# EAGLE schematic VoltageControlledEuclideanSequencer (EAGLE 6.6.0)
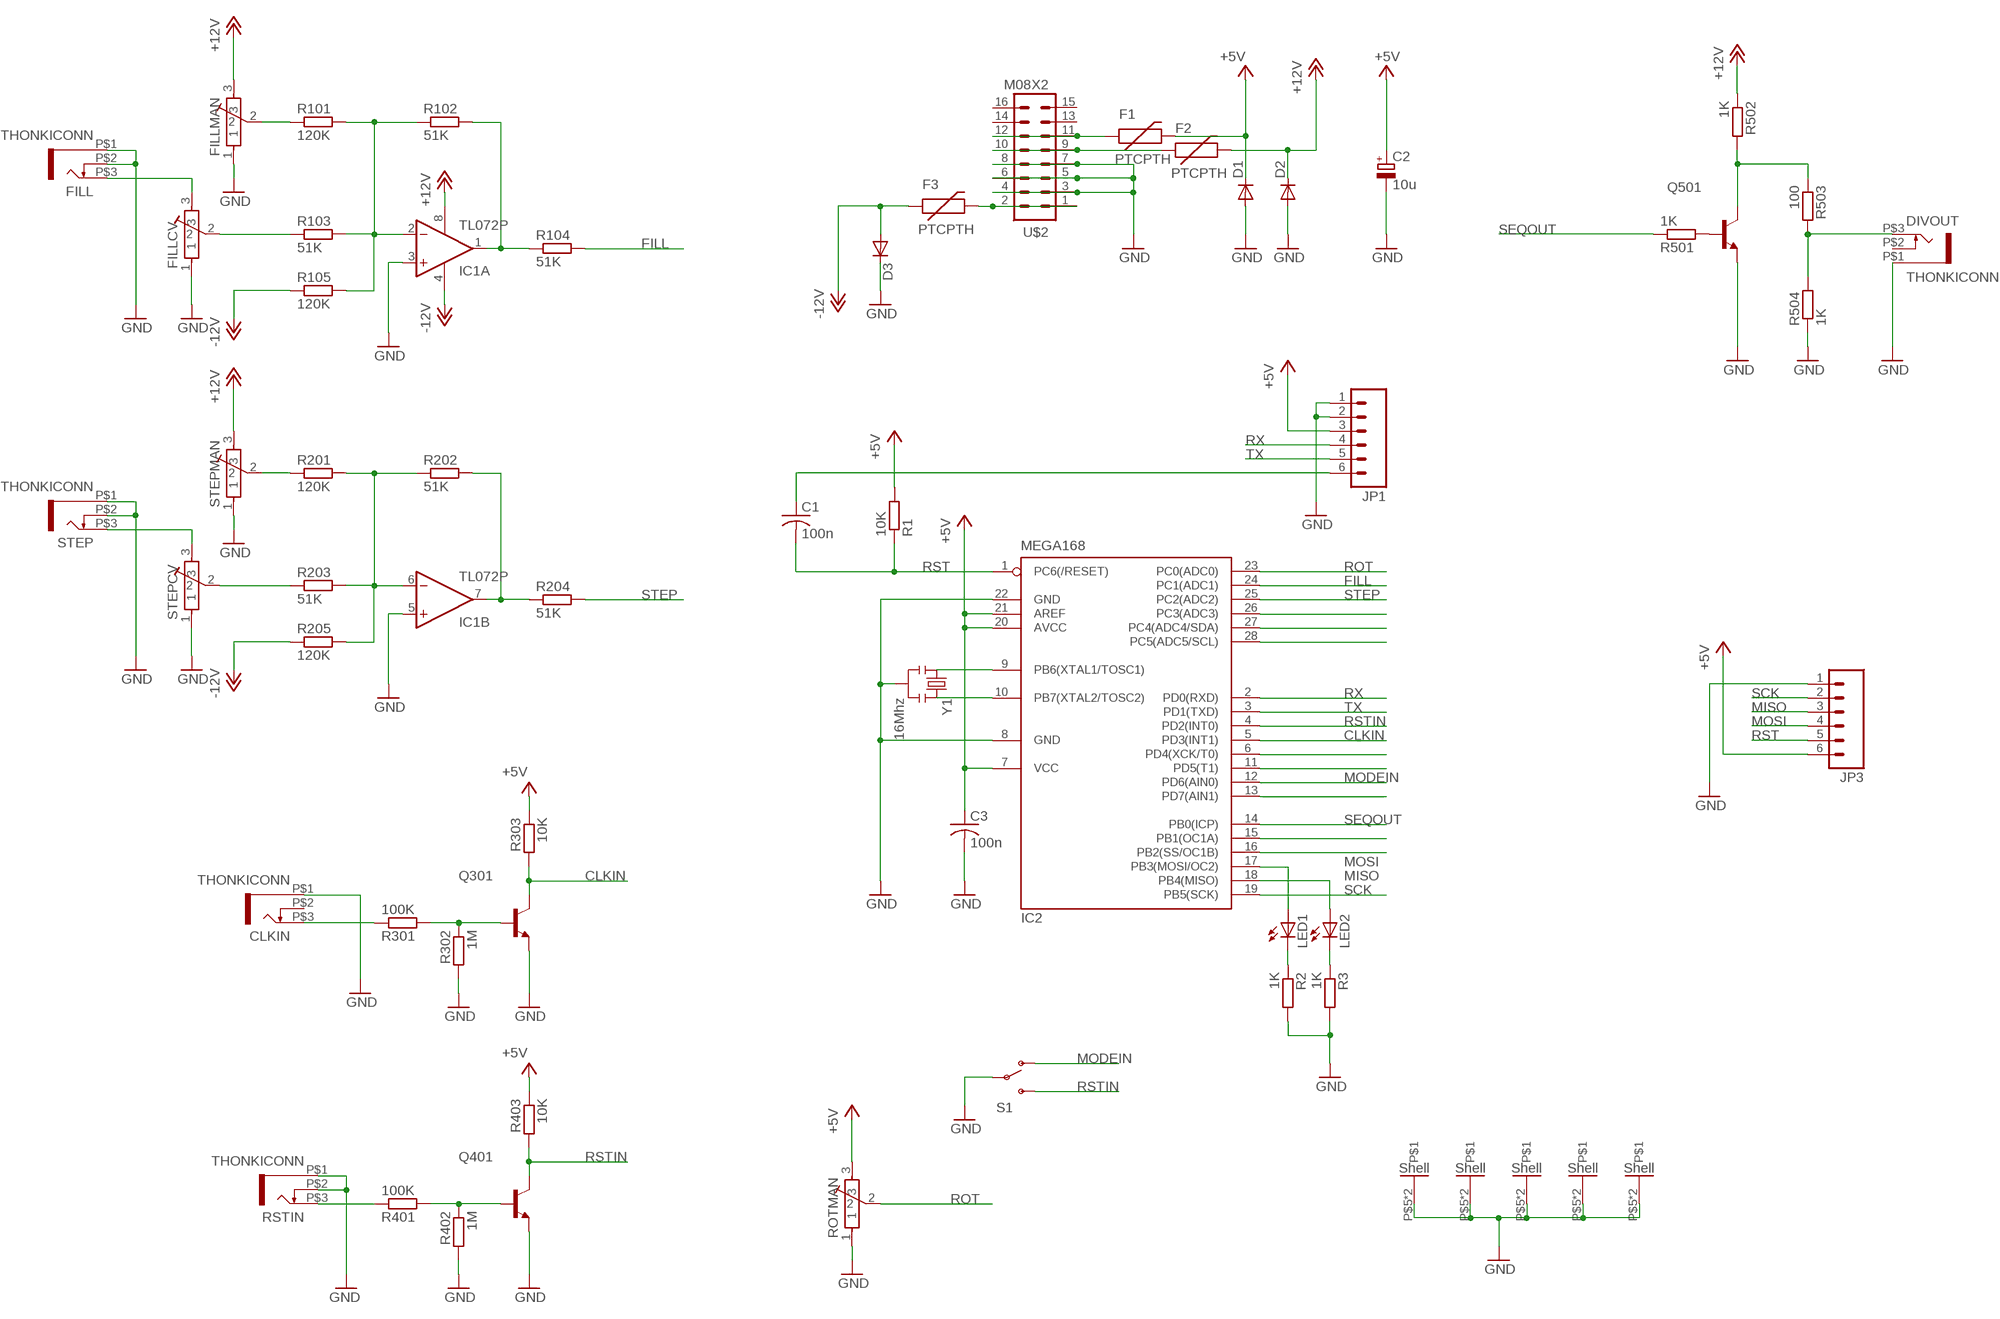
[diagram p0: schematic, sheet 1]

## Parts
C1  100n  C-US050-024X044  [C050-024X044]
C2  10u  CPOL-EUE2.5-6  [E2,5-6]
C3  100n  C-US050-024X044  [C050-024X044]
CLKIN  THONKICONN  [THONKICONN]
D1  DIODE1N4001  [DIODE-1N4001]
D2  DIODE1N4001  [DIODE-1N4001]
D3  DIODE1N4001  [DIODE-1N4001]
DIVOUT  THONKICONN  [THONKICONN]
F1  PTCPTH  [PTC]
F2  PTCPTH  [PTC]
F3  PTCPTH  [PTC]
FILL  THONKICONN  [THONKICONN]
FILLCV  POT-ALPS-RK09L1140  [POT-ALPS-RK09L1140]
FILLMAN  POT-ALPS-RK09L1140  [POT-ALPS-RK09L1140]
IC1  TL072P  [DIL08]
IC2  MEGA168  MEGA8-P  [DIL28-3]
JP1  M06SIP  [1X06]
JP3  M06SIP  [1X06]
LED1  LED3MM  [LED3MM]
LED2  LED3MM  [LED3MM]
Q301  2N3904-NPN-TO92-EBC  [TO92-EBC]
Q401  2N3904-NPN-TO92-EBC  [TO92-EBC]
Q501  2N3904-NPN-TO92-EBC  [TO92-EBC]
R1  10K  R-EU_0204/7  [0204/7]
R2  1K  R-EU_0204/7  [0204/7]
R3  1K  R-EU_0204/7  [0204/7]
R101  120K  R-EU_0204/7  [0204/7]
R102  51K  R-EU_0204/7  [0204/7]
R103  51K  R-EU_0204/7  [0204/7]
R104  51K  R-EU_0204/7  [0204/7]
R105  120K  R-EU_0204/7  [0204/7]
R201  120K  R-EU_0204/7  [0204/7]
R202  51K  R-EU_0204/7  [0204/7]
R203  51K  R-EU_0204/7  [0204/7]
R204  51K  R-EU_0204/7  [0204/7]
R205  120K  R-EU_0204/7  [0204/7]
R301  100K  R-EU_0204/7  [0204/7]
R302  1M  R-EU_0204/7  [0204/7]
R303  10K  R-EU_0204/7  [0204/7]
R401  100K  R-EU_0204/7  [0204/7]
R402  1M  R-EU_0204/7  [0204/7]
R403  10K  R-EU_0204/7  [0204/7]
R501  1K  R-EU_0204/7  [0204/7]
R502  1K  R-EU_0204/7  [0204/7]
R503  100  R-EU_0204/7  [0204/7]
R504  1K  R-EU_0204/7  [0204/7]
ROTMAN  POT-ALPS-RK09L1140  [POT-ALPS-RK09L1140]
RSTIN  THONKICONN  [THONKICONN]
S1  SWITCH-SPST  [SWITCH-SPDT-SALECOM-T8014]
STEP  THONKICONN  [THONKICONN]
STEPCV  POT-ALPS-RK09L1140  [POT-ALPS-RK09L1140]
STEPMAN  POT-ALPS-RK09L1140  [POT-ALPS-RK09L1140]
U$2  M08X2  [2X8]
Y1  16Mhz  RESONATORPTH  [RESONATOR-PTH]

## Nets
+5V: C2.+ C3.1 D1.C F1.P$2 IC2.7(VCC) IC2.20(AVCC) IC2.21(AREF) JP1.3 JP3.6 R1.2 R303.1 R403.1 ROTMAN.3
+12V: D2.C F2.P$2 FILLMAN.3 IC1.8(P:V+) R502.1 STEPMAN.3
-12V: D3.A F3.P$1 IC1.4(P:V-) R105.1 R205.1
ALT: IC2.11(PD5(T1))
CLKIN: IC2.5(PD3(INT1)) Q301.C R303.2
CMBOUT: IC2.16(PB2(SS/OC1B))
DELOUT: IC2.15(PB1(OC1A))
FILL: IC2.24(PC1(ADC1)) R104.2
GND: C2.- C3.2 CLKIN.P$1 D1.A D2.A D3.C DIVOUT.P$1 FILL.P$1 FILL.P$2 FILLCV.1 FILLCV.P$5 FILLCV.P$6 FILLMAN.1 FILLMAN.P$5 FILLMAN.P$6 IC1.3(A:+IN) IC1.5(B:+IN) IC2.8(GND) IC2.22(GND) JP1.1 JP1.2 JP3.1 Q301.E Q401.E Q501.E R2.2 R3.2 R302.2 R402.2 R504.1 ROTMAN.1 ROTMAN.P$5 ROTMAN.P$6 RSTIN.P$1 RSTIN.P$2 S1.2(P) STEP.P$1 STEP.P$2 STEPCV.1 STEPCV.P$5 STEPCV.P$6 STEPMAN.1 STEPMAN.P$5 STEPMAN.P$6 U$2.3 U$2.4 U$2.5 U$2.6 U$2.7 U$2.8 Y1.2
MISO: IC2.18(PB4(MISO)) JP3.3 LED2.A
MODEB: IC2.13(PD7(AIN1))
MODEIN: IC2.12(PD6(AIN0)) S1.1(O)
MOSI: IC2.17(PB3(MOSI/OC2)) JP3.4 LED1.A
N$1: FILL.P$3 FILLCV.3
N$2: IC1.2(A:-IN) R101.2 R102.1 R103.2 R105.2
N$3: FILLMAN.2 R101.1
N$4: IC1.1(A:OUT) R102.2 R104.1
N$5: FILLCV.2 R103.1
N$6: F3.P$2 U$2.1 U$2.2
N$7: IC1.6(B:-IN) R201.2 R202.1 R203.2 R205.2
N$8: R201.1 STEPMAN.2
N$9: IC1.7(B:OUT) R202.2 R204.1
N$10: R203.1 STEPCV.2
N$12: STEP.P$3 STEPCV.3
N$15: IC2.26(PC3(ADC3))
N$16: IC2.27(PC4(ADC4/SDA))
N$17: IC2.28(PC5(ADC5/SCL))
N$20: IC2.9(PB6(XTAL1/TOSC1)) Y1.1
N$21: IC2.10(PB7(XTAL2/TOSC2)) Y1.3
N$23: LED1.K(C) R2.1
N$24: LED2.K(C) R3.1
N$27: Q301.B R301.2 R302.1
N$28: CLKIN.P$3 R301.1
N$29: C1.1 JP1.6
N$31: Q401.B R401.2 R402.1
N$33: Q501.B R501.2
N$36: DIVOUT.P$3 R503.2 R504.2
N$37: Q501.C R502.2 R503.1
N$40: R401.1 RSTIN.P$3
N$44: F1.P$1 U$2.11 U$2.12
N$45: F2.P$1 U$2.9 U$2.10
ROT: IC2.23(PC0(ADC0)) ROTMAN.2
RST: C1.2 IC2.1(PC6(/RESET)) JP3.5 R1.1
RSTIN: IC2.4(PD2(INT0)) Q401.C R403.2 S1.3(S)
RX: IC2.2(PD0(RXD)) JP1.4
SCK: IC2.19(PB5(SCK)) JP3.2
SEQOUT: IC2.14(PB0(ICP)) R501.1
STEP: IC2.25(PC2(ADC2)) R204.2
TRIG: IC2.6(PD4(XCK/T0))
TX: IC2.3(PD1(TXD)) JP1.5
Unconnected: CLKIN.P$2 DIVOUT.P$2 U$2.13 U$2.14 U$2.15 U$2.16

## Library data of the parts
C1 C3 = rcl:C-US: CAPACITOR, American symbol
C2 = resistor:CPOL-EU: POLARIZED CAPACITOR, European symbol
CLKIN DIVOUT FILL RSTIN STEP = Rebel:THONKICONN
D1-D3 = Rebel:DIODE: Diode
F1-F3 = Rebel:PTC: Resettable Fuse PTC
FILLCV FILLMAN ROTMAN STEPCV STEPMAN = Rebel:POT-ALPS-RK09L
IC1 = linear:TL072: OP AMP
IC2 = atmel:MEGA8-P: MICROCONTROLLER 8 Kbytes FLASH, 1 kbytes SRAM, 512 bytes EEPROM, USART, 4-channel 10 bit ADC, 2-channel 8 bit ADC Pin compatible with Atmega48, ATMega88, ATMega168 Source: avr.lbr; OC_FARNELL: unknown; OC_NEWARK: unknown
JP1 JP3 = SparkFun:M06: Header 6 Standard 6-pin 0.1" header. Use with straight break away headers (SKU : PRT-00116), right angle break away headers (PRT-00553), swiss pins (PRT-00743), machine pins (PRT-00117), and female headers (PRT-00115). Molex polarized connector foot print use with SKU : PRT-08094 with associated crimp pins and housings. NOTES ON THE VARIANTS LOCK and LOCK_LONGPADS... This footprint was designed to help hold the alignment of a through-hole component (i.e. 6-pin header) while soldering it into place. You may notice that each hole has been shifted either up or down by 0.005 of an inch from it's more standard position (which is a perfectly straight line). This slight alteration caused the pins (the squares in the middle) to touch the edges of the holes. Because they are alternating, it causes a "brace" to hold the component in place. 0.005 has proven to be the perfect amount of "off-center" position when using our standard breakaway headers. Although looks a little odd when you look at the bare footprint, once you have a header in there, the alteration is very hard to notice. Also, if you push a header all the way into place, it is covered up entirely on the bottom side. This idea of altering the position of holes to aid alignment will be further integrated into the Sparkfun Library for other footprints. It can help hold any component with 3 or more connection pins.
LED1 LED2 = Rebel:LED: LED OSRAM: - CHIPLED LG R971, LG N971, LY N971, LG Q971, LY Q971, LO R971, LY R971 LH N974, LH R974 LS Q976, LO Q976, LY Q976 LO Q996 - Hyper CHIPLED LW Q18S LB Q993, LB Q99A, LB R99A - SideLED LS A670, LO A670, LY A670, LG A670, LP A670 LB A673, LV A673, LT A673, LW A673 LH A674 LY A675 LS A676, LA A676, LO A676, LY A676, LW A676 LS A679, LY A679, LG A679 - Hyper Micro SIDELED® LS Y876, LA Y876, LO Y876, LY Y876 LT Y87S - SmartLED LW L88C, LW L88S LB L89C, LB L89S, LG L890 LS L89K, LO L89K, LY L89K LS L896, LA L896, LO L896, LY L896 - TOPLED LS T670, LO T670, LY T670, LG T670, LP T670 LSG T670, LSP T670, LSY T670, LOP T670, LYG T670 LG T671, LOG T671, LSG T671 LB T673, LV T673, LT T673, LW T673 LH T674 LS T676, LA T676, LO T676, LY T676, LB T676, LH T676, LSB T676, LW T676 LB T67C, LV T67C, LT T67C, LS T67K, LO T67K, LY T67K, LW E67C LS E67B, LA E67B, LO E67B, LY E67B, LB E67C, LV E67C, LT E67C LW T67C LS T679, LY T679, LG T679 LS T770, LO T770, LY T770, LG T770, LP T770 LB T773, LV T773, LT T773, LW T773 LH T774 LS E675, LA E675, LY E675, LS T675 LS T776, LA T776, LO T776, LY T776, LB T776 LHGB T686 LT T68C, LB T68C - Hyper Mini TOPLED® LB M676 - Mini TOPLED Santana® LG M470 LS M47K, LO M47K, LY M47K Source: http://www.osram.convergy.de LUXEON: - LUMILED® LXK2-PW12-R00, LXK2-PW12-S00, LXK2-PW14-U00, LXK2-PW14-V00 LXK2-PM12-R00, LXK2-PM12-S00, LXK2-PM14-U00 LXK2-PE12-Q00, LXK2-PE12-R00, LXK2-PE12-S00, LXK2-PE14-T00, LXK2-PE14-U00 LXK2-PB12-K00, LXK2-PB12-L00, LXK2-PB12-M00, LXK2-PB14-N00, LXK2-PB14-P00, LXK2-PB14-Q00 LXK2-PR12-L00, LXK2-PR12-M00, LXK2-PR14-Q00, LXK2-PR14-R00 LXK2-PD12-Q00, LXK2-PD12-R00, LXK2-PD12-S00 LXK2-PH12-R00, LXK2-PH12-S00 LXK2-PL12-P00, LXK2-PL12-Q00, LXK2-PL12-R00 Source: www.luxeon.com KINGBRIGHT: KA-3528ASYC Source: www.kingbright.com
Q301 Q401 Q501 = transistor-neu-to92:*-NPN-: NPN Transistror
R1-R3 R101-R105 R201-R205 R301-R303 R401-R403 R501-R504 = Rebel:R-EU_: RESISTOR, European symbol
S1 = Rebel:SWITCH-SPST: SPST Switch Simple slide switch. Spark Fun Electronics SKU : COM-00102
U$2 = SparkFun:M08X2
Y1 = SparkFun:RESONATOR: Resonator Small SMD resonator. This is the itty bitty 10/20MHz resonators with built in caps. CSTCE10M0G55 and CSTCE20M0V53. Footprint has been reviewed closely but hasn't been tested yet.